# EAGLE design mainboard (EAGLE 5.11)
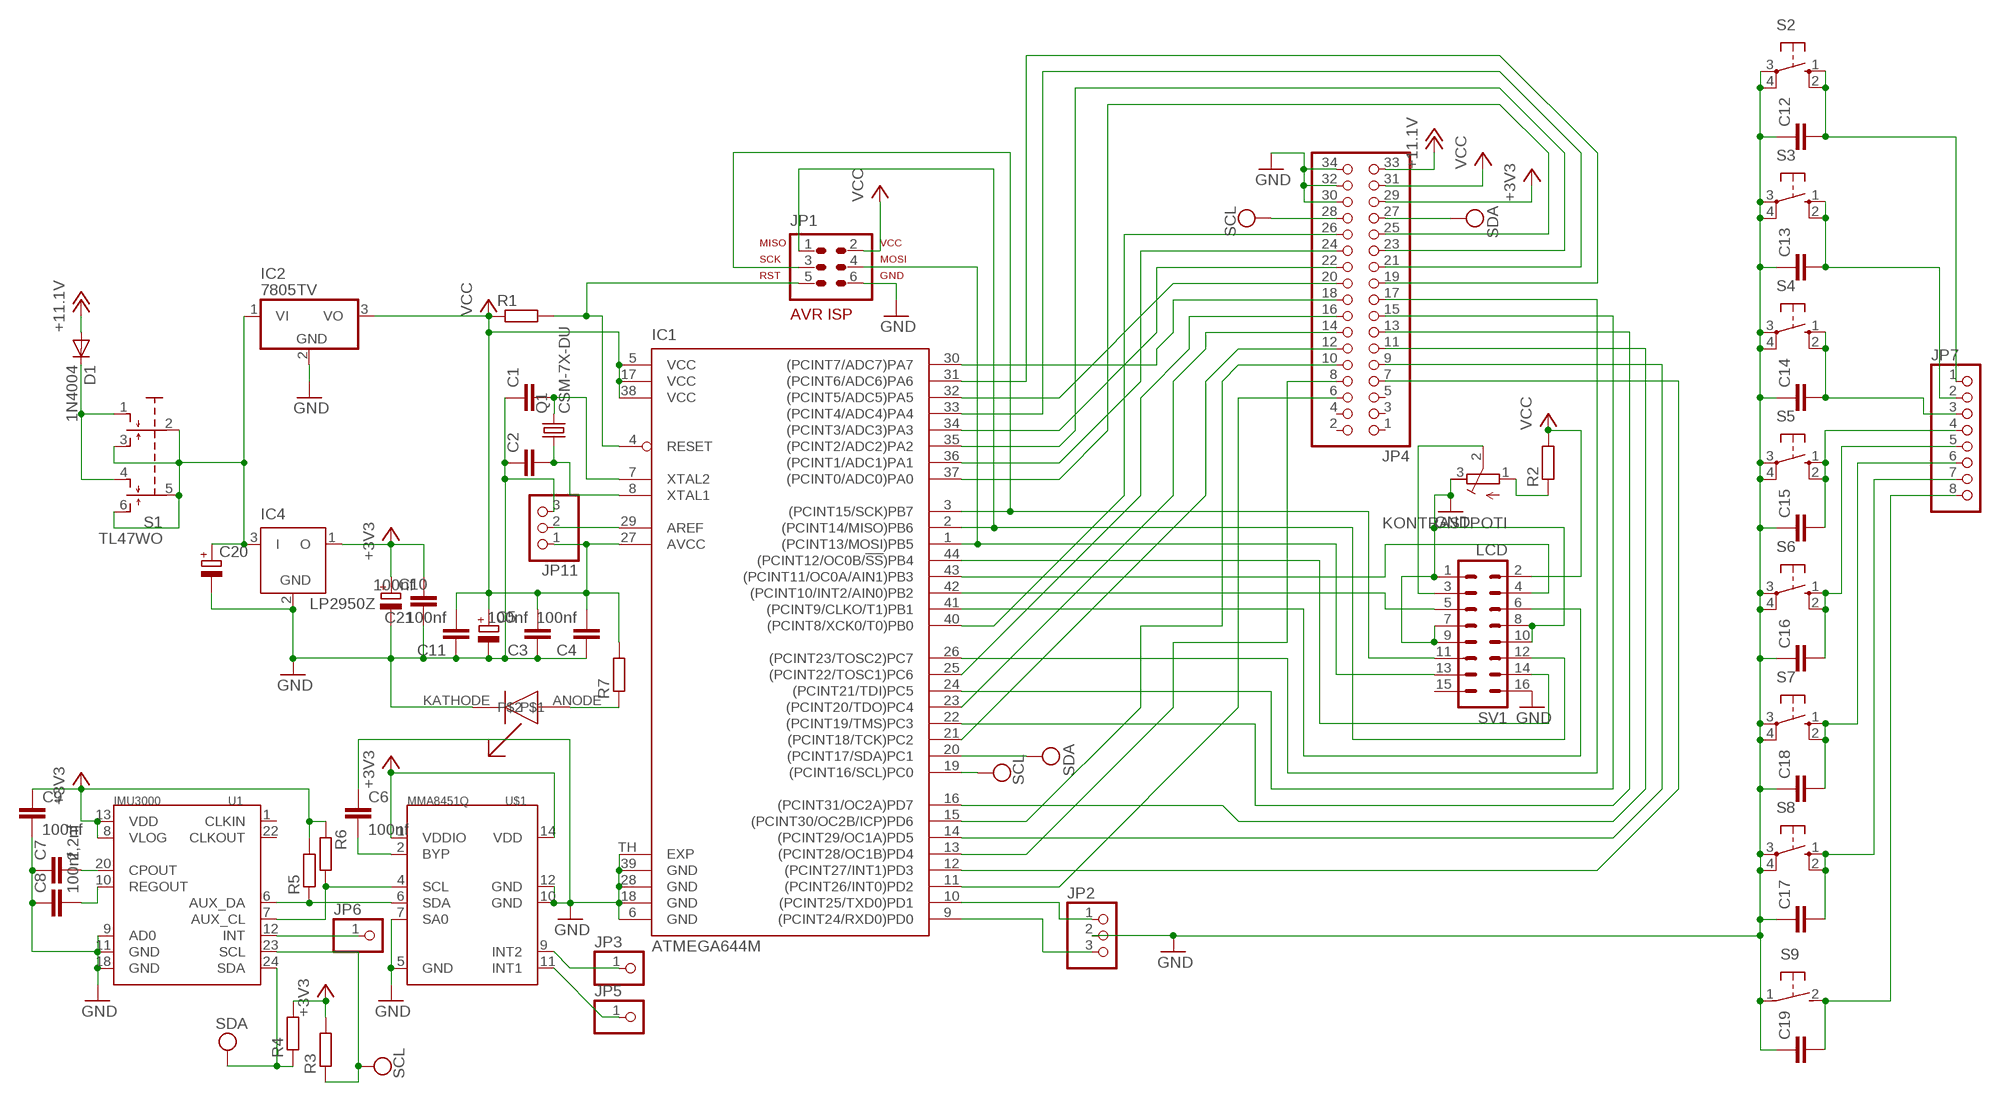
[diagram p0: schematic, sheet 1]

## Parts
C1  C-EUC0805  [C0805]
C2  C-EUC0805  [C0805]
C3  100nf  C-EUC0805  [C0805]
C4  100nf  C-EUC0805  [C0805]
C5  CPOL-EUUD-6,3X7,7  [UD-6,3X7,7_NICHICON]
C6  100nf  C-EUC0805K  [C0805K]
C7  2,2nf  C-EUC0805  [C0805]
C8  100nf  C-EUC0805  [C0805]
C9  100nf  C-EUC0805  [C0805]
C10  CPOL-EUUD-6,3X7,7  [UD-6,3X7,7_NICHICON]
C11  100nf  C-EUC0805  [C0805]
C12  C-EU050-024X044  [C050-024X044]
C13  C-EU050-024X044  [C050-024X044]
C14  C-EU050-024X044  [C050-024X044]
C15  C-EU050-024X044  [C050-024X044]
C16  C-EU050-024X044  [C050-024X044]
C17  C-EU050-024X044  [C050-024X044]
C18  C-EU050-024X044  [C050-024X044]
C19  C-EU050-024X044  [C050-024X044]
C20  CPOL-EUE5-8.5  [E5-8,5]
C21  100nf  C-EUC0805  [C0805]
D1  1N4004  [DO41-10]
IC1  ATMEGA644M  [MLF44-TH]
IC2  7805TV  [TO220V]
IC4  LP2950Z  [TO92]
JP1  AVR-ISP-6HORZ  [AVR-ISP-6R]
JP2  PINHD-1X3/90  [1X03/90]
JP3  PINHD-1X1  [1X01]
JP4  PINHD-2X17/90  [2X17/90]
JP5  PINHD-1X1  [1X01]
JP6  PINHD-1X1  [1X01]
JP7  PINHD-1X8  [1X08]
JP11  PINHD-1X3/90  [1X03/90]
KONTRASTPOTI  R-TRIMM3165W  [RTRIM3165W]
Q1  CSM-7X-DU  [CSM-7X-DU]
R1  R-EU_M0805  [M0805]
R2  R-EU_M0805  [M0805]
R3  R-EU_M0805  [M0805]
R4  R-EU_M0805  [M0805]
R5  R-EU_M0805  [M0805]
R6  R-EU_M0805  [M0805]
R7  R-EU_M0805  [M0805]
S1  TL47WO  [TL4XWO]
S2  10-XX  [B3F-10XX]
S3  10-XX  [B3F-10XX]
S4  10-XX  [B3F-10XX]
S5  10-XX  [B3F-10XX]
S6  10-XX  [B3F-10XX]
S7  10-XX  [B3F-10XX]
S8  10-XX  [B3F-10XX]
S9  31-XX  [B3F-31XX]
SV1  LCD  ML16  [ML16]
U1  IMU3000  [QFN-24]
U$1  MMA8451Q  [QFN16-4X4]
U$2  LEDG3528  [G3528]

## Nets
+3V3: C9.1 C10.+ C21.2 IC4.1(O) JP4.29 R3.2 R4.2 R5.2 R6.1 U1.8(VLOG) U1.13(VDD) U$1.1(VDDIO) U$1.14(VDD)
+12V: D1.A JP4.33 ; supply symbol labelled +11.1V
GND: C1.1 C2.1 C3.1 C4.1 C5.- C6.1 C7.1 C8.1 C9.2 C10.- C11.1 C12.1 C13.1 C14.1 C15.1 C16.1 C17.1 C18.1 C19.1 C20.- C21.1 IC1.6(GND) IC1.18(GND) IC1.28(GND) IC1.39(GND) IC1.TH(EXP) IC2.2(GND) IC4.2(GND) JP1.6 JP2.2 JP4.30 JP4.32 JP4.34 JP11.3 KONTRASTPOTI.3(A) S2.3(P) S2.4(P1) S3.3(P) S3.4(P1) S4.3(P) S4.4(P1) S5.3(P) S5.4(P1) S6.3(P) S6.4(P1) S7.3(P) S7.4(P1) S8.3(P) S8.4(P1) S9.1(P) SV1.1 SV1.7 SV1.8 SV1.9 SV1.10 SV1.16 U1.9(AD0) U1.11(GND) U1.18(GND) U$1.5(GND) U$1.7(SA0) U$1.10(GND) U$1.12(GND) U$2.KATHODE
MISO: IC1.42((PCINT10/INT2/AIN0)PB2) SV1.5
MOSI: IC1.43((PCINT11/OC0A/AIN1)PB3) SV1.4
N$1: KONTRASTPOTI.1(E) R2.1
N$2: JP6.1 U1.12(INT)
N$3: IC1.3((PCINT15/SCK)PB7) JP1.3 SV1.11
N$4: KONTRASTPOTI.2(S) SV1.3
N$5: C2.2 IC1.8(XTAL1) Q1.1
N$6: C1.2 IC1.7(XTAL2) Q1.2
N$7: IC1.10((PCINT25/TXD0)PD1) JP2.1
N$8: IC1.9((PCINT24/RXD0)PD0) JP2.3
N$9: IC1.44((PCINT12/OC0B/!SS!)PB4) SV1.14
N$10: IC1.30((PCINT7/ADC7)PA7) JP4.18
N$11: IC1.22((PCINT19/TMS)PC3) JP4.13
N$12: IC1.21((PCINT18/TCK)PC2) JP4.12
N$13: IC1.1((PCINT13/MOSI)PB5) JP1.4 SV1.13
N$14: IC1.31((PCINT6/ADC6)PA6) JP4.19
N$15: IC1.26((PCINT23/TOSC2)PC7) JP4.17
N$16: IC1.25((PCINT22/TOSC1)PC6) JP4.16
N$17: IC1.24((PCINT21/TDI)PC5) JP4.15
N$18: IC1.23((PCINT20/TDO)PC4) JP4.14
N$19: IC1.16((PCINT31/OC2A)PD7) JP4.11
N$20: IC1.15((PCINT30/OC2B/ICP)PD6) JP4.10
N$22: IC1.14((PCINT29/OC1A)PD5) JP4.9
N$23: IC1.13((PCINT28/OC1B)PD4) JP4.8
N$24: IC1.12((PCINT27/INT1)PD3) JP4.7
N$25: IC1.40((PCINT8/XCK0/T0)PB0) JP4.26
N$26: IC1.11((PCINT26/INT0)PD2) JP4.6
N$27: JP3.1 U$1.9(INT2)
N$28: JP5.1 U$1.11(INT1)
N$32: IC1.29(AREF) JP11.2
N$33: R5.1 U1.6(AUX_DA) U$1.6(SDA)
N$34: R6.2 U1.7(AUX_CL) U$1.4(SCL)
N$36: IC1.2((PCINT14/MISO)PB6) JP1.1 SV1.12
N$38: IC1.33((PCINT4/ADC4)PA4) JP4.21
N$40: IC1.34((PCINT3/ADC3)PA3) JP4.22
N$41: IC1.35((PCINT2/ADC2)PA2) JP4.23
N$42: C8.2 U1.10(REGOUT)
N$43: C7.2 U1.20(CPOUT)
N$44: C6.2 U$1.2(BYP)
N$45: IC1.36((PCINT1/ADC1)PA1) JP4.24
N$46: IC1.37((PCINT0/ADC0)PA0) JP4.25
N$48: IC1.32((PCINT5/ADC5)PA5) JP4.20
N$52: D1.C S1.1(O) S1.4(O1)
N$54: R7.1 U$2.ANODE
N$56: C12.2 JP7.1 S2.1(S) S2.2(S1)
N$57: C13.2 JP7.2 S3.1(S) S3.2(S1)
N$58: C14.2 JP7.3 S4.1(S) S4.2(S1)
N$59: C15.2 JP7.4 S5.1(S) S5.2(S1)
N$60: C16.2 JP7.5 S6.1(S) S6.2(S1)
N$61: C18.2 JP7.6 S7.1(S) S7.2(S1)
N$62: C17.2 JP7.7 S8.1(S) S8.2(S1)
N$63: C19.2 JP7.8 S9.2(S)
N$74: C20.+ IC2.1(VI) IC4.3(I) S1.2(P) S1.3(S) S1.5(P1) S1.6(S1)
RESET: IC1.4(RESET) JP1.5 R1.2
SCK: IC1.41((PCINT9/CLKO/T1)PB1) SV1.6
VCC: C3.2 C4.2 C5.+ C11.2 IC1.5(VCC) IC1.17(VCC) IC1.27(AVCC) IC1.38(VCC) IC2.3(VO) JP1.2 JP4.31 JP11.1 R1.1 R2.2 R7.2 SV1.2
VDD: IC1.20((PCINT17/SDA)PC1) JP4.27 R4.1 U1.24(SDA) ; supply symbol labelled SDA
VSS: IC1.19((PCINT16/SCL)PC0) JP4.28 R3.1 U1.23(SCL) ; supply symbol labelled SCL
Unconnected: JP4.1 JP4.2 JP4.3 JP4.4 JP4.5 SV1.15 U1.1(CLKIN) U1.22(CLKOUT)

## Library data of the parts
C1-C4 C11 C21 = rcl:C-EU: CAPACITOR, European symbol
C5 C10 C20 = rcl:CPOL-EU: POLARIZED CAPACITOR, European symbol
C6-C9 C12-C19 = resistor:C-EU: CAPACITOR, European symbol
D1 = diode:1N4004: DIODE general purpose rectifier, 1 A
IC1 = atmel:ATMEGA644*: 8-bit Microcontroller with 64K Bytes In-System Programmable Flash Source: http://www.atmel.com/dyn/resources/prod_documents/doc2593.pdf; MPN: ATMEGA644P-20MU; OC_FARNELL: 1748528; OC_NEWARK: 26R5636
IC2 = linear:78*: Positive VOLTAGE REGULATOR Source: http://cache.national.com/ds/LM/LM78L05.pdf http://www.fairchildsemi.com/ds/LM/LM7805.pdf
IC4 = linear:LP2950: 100 mA, Low Power Low Dropout Voltage Regulator Source: http://www.onsemi.com/pub/Collateral/LP2950-D.PDF
JP1 = avr-7:AVR-ISP-6: AVR ISP-6 Serial Programming Header
JP2 JP11 = pinhead:PINHD-1X3: PIN HEADER
JP3 JP5 JP6 = pinhead:PINHD-1X1: PIN HEADER
JP4 = pinhead:PINHD-2X17: PIN HEADER
JP7 = pinhead:PINHD-1X8: PIN HEADER
KONTRASTPOTI = resistor:R-TRIMM: Trimm resistor
Q1 = crystal:CSM-7X-DU: SMD CRYSTAL Source: www.ecsxtal.com .. Crystal 3.6864MHz CSM_7X_DU.PDF; OC_FARNELL: unknown; OC_NEWARK: unknown
R1-R7 = resistor:R-EU_: RESISTOR, European symbol
S1 = switch:TL47WO: TINY SWITCH MOM OFF MOM Source: http://www2.produktinfo.conrad.com/datenblaetter/700000-724999/705152-da-01-de-Subminiaturschalter_TL_36WO.pdf
S2-S8 = switch-omron:10-XX: OMRON SWITCH; MPN: B3F-1000; OC_FARNELL: 176432; OC_NEWARK: 36M3542
S9 = switch-omron:31-XX: OMRON SWITCH; MPN: B3F-3100; OC_FARNELL: 959704; OC_NEWARK: 36M3582
SV1 = con-harting-ml:ML16: HARTING; OC_FARNELL: unknown; OC_NEWARK: unknown
U1 = Quadro:IMU3000
U$1 = Quadro:MMA8451Q
U$2 = custom:LEDG3528: LED, G3528-package SMD 3,5 x 2,8mm

## Board
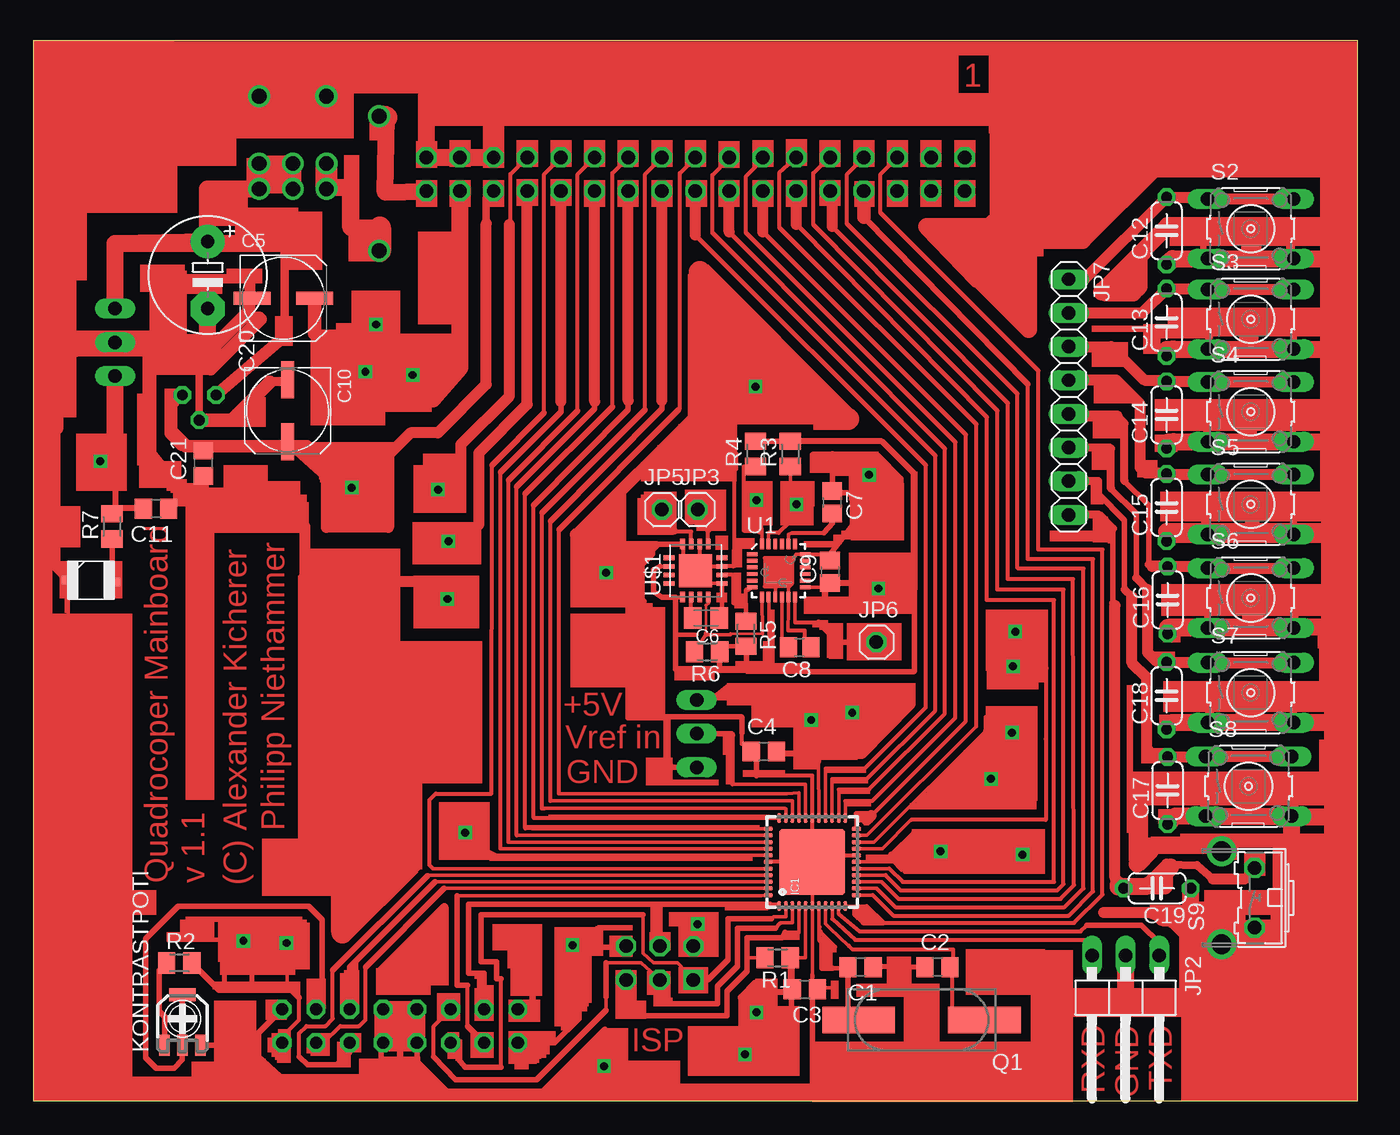
[diagram p1: board, top side]
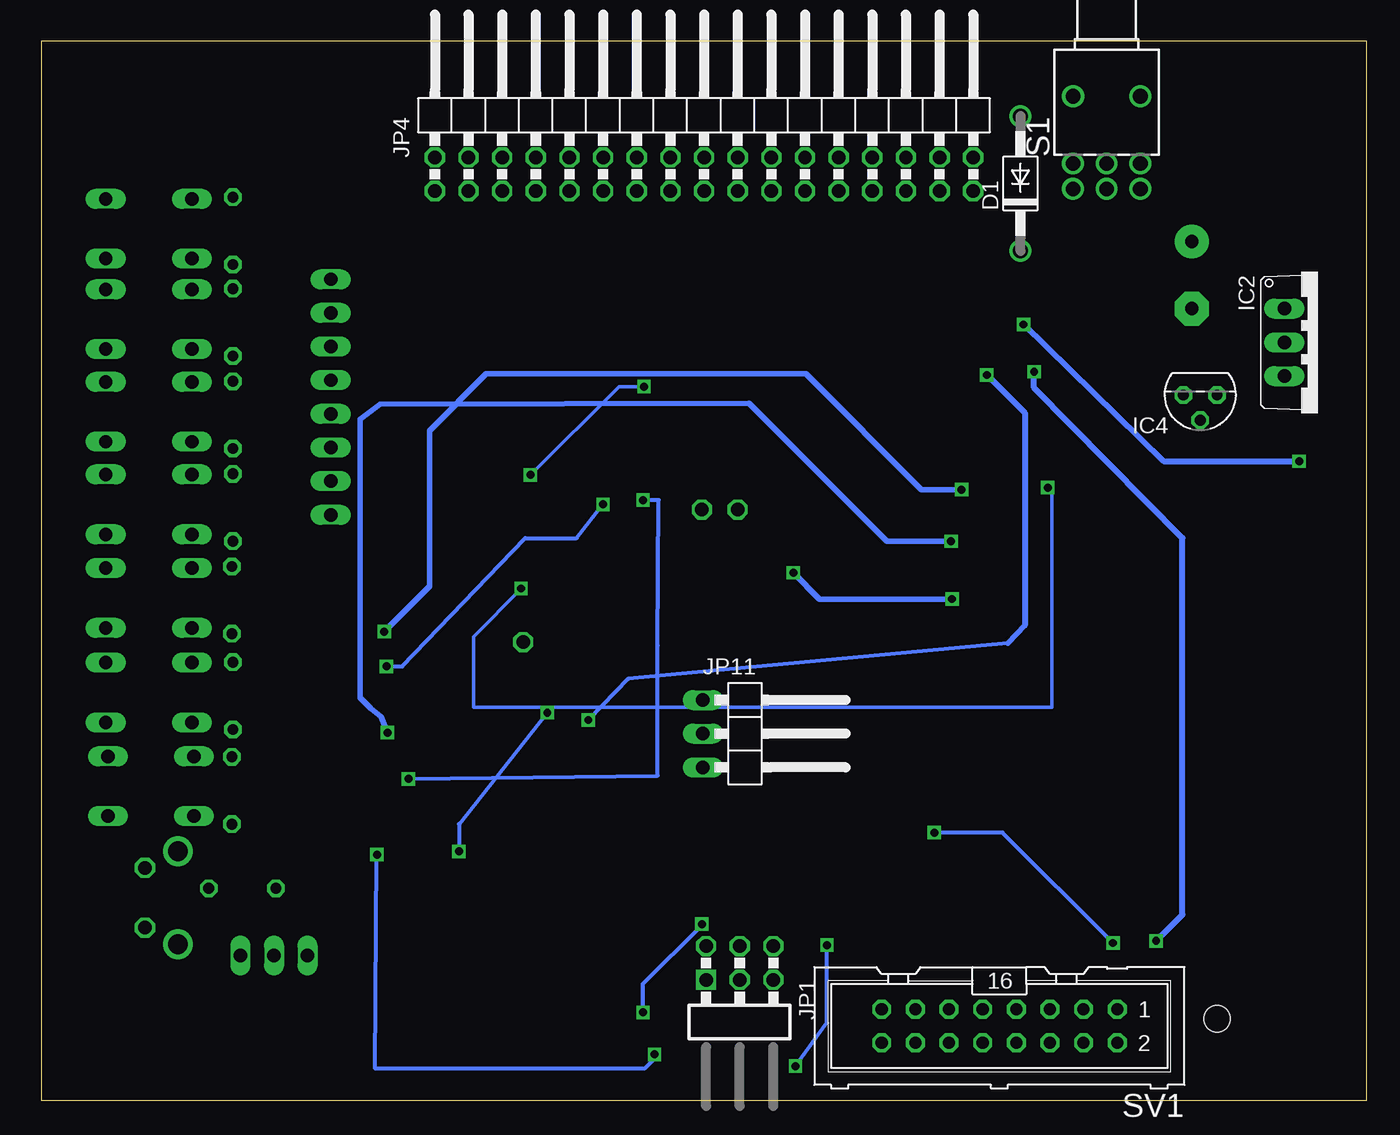
[diagram p2: board, bottom side, seen from below]

Size 100 x 80 mm. Coordinates in mm from the lower left corner, seen from the top.
Outline: 0,0 100,0 100,80 0,80 0,0
Copper layers (1*16): Top 0.035mm / dielectric 1.5mm / Bottom 0.035mm
Design rules "default": minimum track width 10mil, minimum drill 24mil, track to track 8mil, track to pad 8mil, pad to pad 8mil, via to via 8mil, smd to smd 8mil, copper to edge 40mil, drill to drill 8mil, minimum pad ring 10mil, minimum via ring 8mil, stop-mask expansion 4mil, vias tented up to drill 0mil, thermal gap 10mil

### Footprints (pad centres in the part's own frame; a part is rotated, then mirrored left to right if it is on the bottom)
C0805 = smd 1.3 x 1.5: 1 -0.95,0; 2 0.95,0
UD-6,3X7,7_NICHICON = smd 2.8 x 1: + 2.35,0; - -2.35,0
C0805K = smd 1.3 x 1.6: 1 -1,0; 2 1,0
C0805' = smd 1.3 x 1.5: 1 -0.85,0; 2 0.85,0
C050-024X044 = drill 0.813 octagon: 1 -2.54,0; 2 2.54,0
E5-8,5 = drill 1.016 pad 2.54 round: + -2.54,0 | drill 1.016 pad 2.54 octagon: - 2.54,0
DO41-10 = drill 1.118 round: A 5.08,0; C -5.08,0
MLF44-TH = smd 0.7 x 0.3: 1 -3.325,2.5; 2 -3.325,2; 3 -3.325,1.5; 4 -3.325,1; 5 -3.325,0.5; 6 -3.325,0; 7 -3.325,-0.5; 8 -3.325,-1; 9 -3.325,-1.5; 10 -3.325,-2; 11 -3.325,-2.5; 23 3.325,-2.5; 24 3.325,-2; 25 3.325,-1.5; 26 3.325,-1; 27 3.325,-0.5; 28 3.325,0; 29 3.325,0.5; 30 3.325,1; 31 3.325,1.5; 32 3.325,2; 33 3.325,2.5 | smd 0.3 x 0.7: 12 -2.5,-3.325; 13 -2,-3.325; 14 -1.5,-3.325; 15 -1,-3.325; 16 -0.5,-3.325; 17 0,-3.325; 18 0.5,-3.325; 19 1,-3.325; 20 1.5,-3.325; 21 2,-3.325; 22 2.5,-3.325; 34 2.5,3.325; 35 2,3.325; 36 1.5,3.325; 37 1,3.325; 38 0.5,3.325; 39 0,3.325; 40 -0.5,3.325; 41 -1,3.325; 42 -1.5,3.325; 43 -2,3.325; 44 -2.5,3.325 | smd 5 x 5: TH 0,0
TO220V = drill 1.016 long: 1 -2.54,-2.54; 2 0,-2.54; 3 2.54,-2.54
TO92 = drill 0.813 octagon: 1 -1.27,0; 2 0,1.905; 3 1.27,0
AVR-ISP-6R = drill 1.016 square: 1 -2.54,-1.27 | drill 1.016 octagon: 2 -2.54,1.27; 3 0,-1.27; 4 0,1.27; 5 2.54,-1.27; 6 2.54,1.27
1X03/90 = drill 1.016 long: 1 -2.54,-3.81; 2 0,-3.81; 3 2.54,-3.81
1X01 = drill 1.016 octagon: 1 0,0
2X17/90 = drill 1.016 octagon: 1 -20.32,-6.35; 2 -20.32,-3.81; 3 -17.78,-6.35; 4 -17.78,-3.81; 5 -15.24,-6.35; 6 -15.24,-3.81; 7 -12.7,-6.35; 8 -12.7,-3.81; 9 -10.16,-6.35; 10 -10.16,-3.81; 11 -7.62,-6.35; 12 -7.62,-3.81; 13 -5.08,-6.35; 14 -5.08,-3.81; 15 -2.54,-6.35; 16 -2.54,-3.81; 17 0,-6.35; 18 0,-3.81; 19 2.54,-6.35; 20 2.54,-3.81; 21 5.08,-6.35; 22 5.08,-3.81; 23 7.62,-6.35; 24 7.62,-3.81; 25 10.16,-6.35; 26 10.16,-3.81; 27 12.7,-6.35; 28 12.7,-3.81; 29 15.24,-6.35; 30 15.24,-3.81; 31 17.78,-6.35; 32 17.78,-3.81; 33 20.32,-6.35; 34 20.32,-3.81
1X08 = drill 1.016 long: 1 -8.89,0; 2 -6.35,0; 3 -3.81,0; 4 -1.27,0; 5 1.27,0; 6 3.81,0; 7 6.35,0; 8 8.89,0
RTRIM3165W = smd 0.8 x 1.6: 1 -1.35,-2; 2 0,-2; 3 1.35,-2 | smd 2 x 1: 4 0,1.8 | hole 2: 0,0
CSM-7X-DU = smd 5.5 x 2: 1 -4.75,0; 2 4.75,0
M0805 = smd 1.3 x 1.6: 1 -0.95,0; 2 0.95,0
TL4XWO = drill 1.1 pad 1.422 round: 1 -2.54,-5.08; 2 0,-5.08; 3 2.54,-5.08; 4 -2.54,-6.985; 5 0,-6.985; 6 2.54,-6.985 | drill 1.1 pad 1.676 round: M1 -2.54,0; M2 2.54,0
B3F-10XX = drill 1.016 long: 1 -3.251,2.261; 2 3.251,2.261; 3 -3.251,-2.261; 4 3.251,-2.261
B3F-31XX = drill 1.016 octagon: 1 -2.261,-1.245; 2 2.261,-1.245 | drill 1.499 pad 2.159 round: 3 -3.505,1.245; 4 3.505,1.245
ML16 = drill 0.914 octagon: 1 -8.89,-1.27; 2 -8.89,1.27; 3 -6.35,-1.27; 4 -6.35,1.27; 5 -3.81,-1.27; 6 -3.81,1.27; 7 -1.27,-1.27; 8 -1.27,1.27; 9 1.27,-1.27; 10 1.27,1.27; 11 3.81,-1.27; 12 3.81,1.27; 13 6.35,-1.27; 14 6.35,1.27; 15 8.89,-1.27; 16 8.89,1.27
QFN-24 = smd 0.8 x 0.3: 1 -2,1.25; 2 -2,0.75; 3 -2,0.25; 4 -2,-0.25; 5 -2,-0.75; 6 -2,-1.25; 13 2,-1.25; 14 2,-0.75; 15 2,-0.25; 16 2,0.25; 17 2,0.75; 18 2,1.25 | smd 0.3 x 0.8: 7 -1.25,-2; 8 -0.75,-2; 9 -0.25,-2; 10 0.25,-2; 11 0.75,-2; 12 1.25,-2; 19 1.25,2; 20 0.75,2; 21 0.25,2; 22 -0.25,2; 23 -0.75,2; 24 -1.25,2
QFN16-4X4 = smd 0.8 x 0.35: 1 -2,0.975; 2 -2,0.325; 3 -2,-0.325; 4 -2,-0.975; 9 2,-0.975; 10 2,-0.325; 11 2,0.325; 12 2,0.975 | smd 0.35 x 0.8: 5 -0.975,-2; 6 -0.325,-2; 7 0.325,-2; 8 0.975,-2; 13 0.975,2; 14 0.325,2; 15 -0.325,2; 16 -0.975,2 | smd 2.5 x 2.5: EXP 0,0
G3528 = smd 1.27 x 0.635: ANODE 1.587,-0.159; KATHODE -1.587,0

### Placement (x,y rotation side)
C1  62.47,10.08 180 top
C2  68.26,10.08 0 top
C3  58.26,8.41 180 top
C4  55.17,26.35 0 top
C5  18.89,60.56 0 top
C6  50.8,36.43 180 top
C7  2,2nf  [C0805']  60.33,45.16 270 top
C8  100nf  [C0805']  57.86,34.21 180 top
C9  100nf  [C0805']  60.17,39.93 90 top
C10  19.21,52.07 270 top
C11  9.29,44.69 180 top
C12  85.57,65.64 90 top
C13  85.57,58.74 90 top
C14  85.57,51.75 90 top
C15  85.57,44.77 90 top
C16  85.65,37.78 90 top
C17  85.65,23.42 90 top
C18  85.57,30.56 90 top
C19  84.85,16.03 180 top
C20  13.18,62.31 270 top
C21  12.86,48.1 90 top
D1  26.11,69.22 90 bottom
IC1  58.82,18.02 90 top
IC2  3.65,57.23 270 bottom
IC4  12.54,53.26 180 bottom
JP1  47.31,10.4 0 bottom
JP2  82.47,7.14 180 top
JP3  50.16,44.61 0 top
JP4  50,75 0 bottom
JP5  47.47,44.61 0 top
JP6  63.66,34.61 0 top
JP7  78.18,53.1 270 top
JP11  46.28,27.7 270 bottom
KONTRASTPOTI  11.27,6.19 0 top
Q1  67.07,6.11 180 top
R1  56.2,10.8 180 top
R2  11.03,10.4 0 top
R3  57.15,48.82 90 top
R4  54.53,48.82 90 top
R5  53.82,35.24 270 top
R6  50.88,33.89 180 top
R7  5.95,43.34 90 top
S1  19.61,75.8 0 bottom
S2  91.92,65.8 0 top
S3  91.92,58.98 0 top
S4  91.92,51.99 0 top
S5  91.92,45.01 0 top
S6  91.92,37.94 0 top
S7  91.92,30.8 0 top
S8  91.76,23.73 0 top
S9  90.96,15.32 90 top
SV1  27.7,5.64 180 bottom
U1  56.27,40 0 top
U$1  50,40 90 top
U$2  4.37,39.29 0 top

### Tracks (layer width: path | path; a pad name or v marks a point on that pad's centre or on a via)
+3V3  (via drill 0.6)
  Top 0.254: U$1.1 48.74,37.95 | U$1.14
  Top 0.27: 60.19,39.05 59.89,38.75 U1.13 | R6.1 52.23,34.29 R5.2 53.9,34.21 53.9,32.7 54.05,32.54 55.56,32.54 | 58.42,32.54 55.56,32.54 | U1.8 55.56,37.96 55.56,32.54 | 34.21,54.05 30.48,50.32 28.73,50.32 24.69,46.28 v24.05,46.28 | v63.82,38.66 63.82,39.45 63.34,39.45
  Top 0.305: 48.5,38 U$1.1 | 47.31,40.32 U$1.14
  Top 0.406: R6.1 51.83,32.54 52.55,32.54 48.5,32.54 48.5,33.89 48.5,38 47.49,38 46.83,38.42 46.83,40.08 47.31,40.32 | R4.2 56.99,49.77 R3.2
  Top 0.408: 58.42,32.54 58.58,32.38 66.44,32.38 66.52,32.46 66.52,40.48
  Top 0.45: R3.2 64.06,49.77 66.52,47.31 66.52,40.48 66.52,40.32 66.28,40.08 63.98,40.08 63.34,39.45 62.94,39.05 60.19,39.05 C9.1 | C21.2 12.7,49.21 11.99,49.21
  Top 0.56: IC4.1 | IC4.1 10.32,52.07 10.32,50.56 11.43,49.21 11.99,49.21 18.7,49.21 C10.+ | JP4.29 34.21,68.1 34.21,66.2
  Top 0.813: 34.21,66.2 34.21,54.05 30.56,50.4 28.5,50.4 26.83,48.74 26.83,43.26 22.15,43.26 22.15,47.1 C10.+
  Bottom 0.27: v24.05,46.28 23.73,45.96 23.73,29.69 67.39,29.69 67.39,35 v63.82,38.66
+12V
  Top 1.27: JP4.33 26.59,68.57 26.67,74.22
  Top 1.676: 26.67,74.22 D1.A
GND  (via drill 0.6)
  Top 0.254: IC1.TH arc-90 59.32,18.52 | 82.47,8.57 82.39,8.49 | 26.27,4.37 SV1.8 | 44.69,11.59 JP1.6 | C6.1 52,36.62 | U$1.12 49.05,42.03 | 52.94,40.4 52.86,40.32 | U1.11 57.02,38.76 | U1.18 57.6,41.25 57.31,40.72 | 58.26,34.51 C8.1 | 57.02,38.71 56.99,38.81 | 56.04,38.81 56.04,37.86 U1.9 | 60.46,45.88 C7.1 | 48.02,28.97 48.02,25.64 | 58.82,6.19
  Top 0.27: IC1.TH IC1.6 58.82,9.53 | 56.99,35.48 57.02,37.04 U1.11 57.02,38.71 | 50.96,39.05 51.99,39.05 | 58.82,48.82 61.91,48.82 61.91,47.23 v63.1,47.23 | v54.53,53.9 53.02,52.39 53.02,48.82
  Top 0.305: IC1.39 IC1.TH IC1.28 58.82,24.53 54.61,24.53 54.61,25.8 53.5,26.99 | 59.32,18.52 IC1.18 | 53.5,26.99 53.5,27.78 | 53.5,26.99 53.5,26.91 | 52.86,40.32 U$1.7 | 52.94,41.51 52.94,47.7 53.02,47.7 | 60.33,48.82 58.82,48.82 | 58.82,9.53 58.82,9.29 | 58.82,9.53 | 58.82,8.02 58.82,8.33 | 58.82,8.33 58.82,9.53 | 57.02,38.76 57.31,39.05 57.31,40.72 57.31,40.96 55.24,40.96 55.24,38.81 56.04,38.81 | 56.99,35.48 58.26,35.48 58.26,34.51 | 56.99,38.81 56.12,38.81 | 60.18,41.28 U1.18 60.16,41.25 C9.2 | 64.77,10.16 63.42,10.16 | C3.1 59.21,8.33 58.82,8.33 | 41.2,6.19 40.48,6.19 v40.72,11.75 | 60.35,46.51 60.35,46.04 C7.1 | 52,36.62 U$1.5 | C6.1 51.99,36.62 51.99,39.05 | 50.96,39.05 51.04,39.13 51.04,40.32 51.04,40.33 | 51.04,40.33 U$1.7 | 50.33,41.04 51.04,40.33 | 50.33,41.04 U$1.10 | 49.05,42.03 49.05,41.04 49.06,41.04 50.33,41.04
  Top 0.406: 58.82,8.02 58.82,6.19 58.82,1.03 53.66,1.03 | KONTRASTPOTI.3 16.1,4.19 | 16.1,4.19 SV1.1 | 26.27,4.37 26.27,1.83 18.7,1.83 16.1,4.19 | SV1.16 39.37,4.37 41.2,6.19 41.2,10.4 42.39,11.59 44.69,11.59 | 52.94,40.4 52.94,41.51 | 53.02,47.7 53.02,47.86 53.02,48.82 | 60.35,46.51 60.33,48.82 | SV1.10 28.97,2.94 31.19,0.71 38.5,0.71 43.18,5.4 v43.1,2.62 43.18,1.11 | 43.18,1.11 53.58,1.03 53.54,1.07 | 53.54,1.07 53.66,1.11 43.18,1.11 | JP2.2 | JP2.2 82.47,8.57 | 53.66,1.03 53.58,1.11 66.99,1.11 67.15,6.35 66.12,6.35 66.12,10.08 64.77,10.16 | 43.18,1.11 53.66,1.03 | 53.54,1.07 59.17,1.03 | C1.1 63.42,10.16 C2.1 | 60.18,41.28 61.83,43.42 61.83,45.09 | 61.83,45.09 61.83,45.56 61.44,45.88 60.46,45.88 | 53.5,27.78 53.5,28.89 53.42,28.97 48.02,28.97 47.7,28.97 47.78,28.89 | JP11.3 48.26,25.16 47.78,25.64 47.78,28.89 | 47.78,28.89 44.93,28.89 44.93,37.7 46.12,37.7 45.96,37.78 45.96,40.48 46.75,41.27 46.75,41.59 | 46.75,41.59 47.16,42 U$1.12 | 63.26,45.16 63.18,45.09 61.83,45.09 | 12.94,79.3 13.26,79.3 | 46.75,41.59 45.01,39.85 v43.26,39.85 | U$1.7
  Top 0.408: C10.- 19.08,54.29 | 54.61,24.53 54.61,25.96
  Top 0.45: 54.61,25.96 C4.1 | C21.1 12.62,46.91 12.62,45.4 | C11.1 11.17,45.62 11.49,45.62 11.49,45.58 11.67,45.4
  Top 0.56: IC4.2 12.54,57.07 12.38,57.23 | 17.86,54.21 19,54.21 C10.-
  Top 0.649: 19.08,54.29 17.78,54.29
  Top 0.813: JP2.2 82.47,7.86 78.11,7.86 78.11,1.11 66.99,1.11 | v31.27,37.86 29.61,39.21 20.56,39.21 20.48,39.61 20.48,43.42 18.49,45.4 12.62,45.4 11.67,45.4 8.65,49.13 8.65,56.75 8.18,57.23 | 1.67,50.8 1.67,40.4 U$2.KATHODE
  Top 1.016: IC4.2 15,51.35 17.86,54.21 | C5.- 16.27,60.29 16.27,59.53 13.97,57.23 13.18,57.23
  Top 1.27: SV1.8 SV1.10 SV1.9 SV1.7 SV1.8 | SV1.8 | JP4.30 JP4.32 JP4.34 29.68,72.63 29.69,79.3 12.94,79.3 7.62,79.3 1.59,73.18 1.59,56.52 | 1.59,56.52 IC2.2 8.18,57.23 12.38,57.23 13.18,57.23 C20.- | 1.67,50.8 1.59,56.52 | C17.1 86.24,21.47 S8.3 88.67,21.43 95.57,21.43 | 99.38,28.54 99.38,21.43 95.57,21.43 | 95.57,21.43 95.57,21.47 S8.4 95.01,13.06 S9.1 89.69,12.98 | C19.1 87.39,13.46 89.69,12.98 | C18.1 arc-90 86.08,28.54 S7.3 S7.4 99.38,28.54 | S6.4 S6.3 86.08,35.68 arc90 C16.1 | S2.4 S2.3 86,63.54 C12.1 85.96,63.5 98.98,63.5 98.98,56.72 S3.4 S3.3 86.08,56.72 arc90 C13.1 85.57,56.67 98.98,56.67 98.98,49.73 S4.4 89.25,49.73 arc-90 89.22,49.77 88.7,49.77 arc90 S4.3 86.08,49.73 arc90 C14.1 85.57,49.69 99.14,49.69 99.14,42.74 S5.4 S5.3 86.08,42.74 arc90 C15.1 85.57,42.94 99.3,42.94 99.3,35.72 | 86.12,35.72 C16.1 | 99.3,35.72 99.38,35.72 99.38,28.54 | 99.3,35.72 86.12,35.72 | C16.1 85.65,35.72 86.12,35.72 | JP2.2 82.47,7.46 89.77,7.46 89.69,12.98
  Bottom 0.27: v63.1,47.23 56.44,53.9 v54.53,53.9
  Bottom 0.305: v40.72,11.75 40.72,5.87 v43.1,2.62
  Bottom 0.406: v43.26,39.85 41.27,37.86 v31.27,37.86
MISO
  Top 0.254: SV1.5
  Top 0.27: 30.33,16.52 IC1.42
  Top 0.406: 30.33,16.52 23.89,10.08 SV1.5
MOSI
  Top 0.254: 21.99,4.45 21.43,4.45 SV1.4
  Top 0.27: 31.02,16.02 IC1.43
  Top 0.305: 25.08,10.08 25.08,6.11 24.61,5.64 23.18,5.64 21.99,4.45
  Top 0.406: 25.08,10.08 31.02,16.02
N$1
  Top 0.254: 9.53,9.84 R2.1
  Top 0.406: KONTRASTPOTI.1 9.92,6.35 9.53,6.75 9.53,9.84
N$2
  Top 0.27: U1.12 57.53,36.09
  Top 0.305: 57.53,36.09 59.29,36.12
  Top 0.406: 59.29,36.12 60.17,35.24 60.17,34.61 60.33,34.61 61.67,34.61 JP6.1
N$3
  Top 0.254: 56.04,13.02 | 56.44,13.41 57.32,13.41 IC1.3 | 43.26,6.83 43.26,7.86 | 43.26,10.4 45.88,10.4 JP1.3
  Top 0.305: 56.04,13.02 56.44,13.41 | 30.24,3.33 30.24,5.64 SV1.11
  Top 0.406: JP1.3 47.31,8.18 48.18,7.3 51.67,7.3 51.67,8.65 53.18,10.16 53.18,13.02 56.04,13.02 | 43.26,6.83 38.02,1.59 31.91,1.59 30.24,3.33 | 43.26,7.86 43.26,10.4
N$4
  Top 0.254: 21.83,7.38 SV1.3
  Top 0.406: KONTRASTPOTI.2 11.27,3.1 10.64,2.46 9.29,2.46 8.49,3.25 8.49,12.22 10.95,14.68 20.8,14.68 21.83,13.65 21.83,7.38
N$5
  Top 0.254: IC1.8 59.82,13.37 60.17,13.02 61.56,11.7
  Top 0.305: C2.2 69.42,10.16 69.45,11.43 66.52,11.43 | 66.52,11.43 | 66.52,11.43 | 61.56,11.7 61.88,11.43 66.52,11.43 | 69.37,10.23 69.37,6.11 Q1.1
  Top 0.406: C2.2 69.37,10.23
N$6
  Top 0.254: IC1.7 59.32,13.12 59.37,13.1 | C1.2 60.33,10
  Top 0.305: 59.45,12.06 59.37,12.06 59.37,13.1
  Top 0.406: Q1.2 61.52,6.11 C1.2 | 60.33,10 59.53,10 59.53,12.06 59.45,12.06
N$7
  Top 0.254: 62.39,12.78 62.55,12.78 | 60.8,14.13 60.8,14.71 IC1.10
  Top 0.305: 79.53,13.26 79.06,12.78 62.55,12.78 | 60.8,14.13 62.39,12.78
  Top 0.406: 79.53,13.26 83.66,13.26 85.01,11.91 JP2.1
N$8
  Top 0.254: 60.33,13.73 IC1.9
  Top 0.305: 60.33,13.73 62.07,12.14 79.93,12.14 JP2.3
N$9
  Top 0.254: 54.98,15.48 IC1.44 | 51.12,15.48 50.8,15.48 | 31.99,8.73 31.99,8.81
  Top 0.27: 50.8,15.48 54.98,15.48 | 31.99,15.48 51.12,15.48
  Top 0.305: 32.78,5.64 32.78,8.73
  Top 0.406: 31.99,8.81 31.99,15.48 | 32.78,8.73 31.99,8.73 | SV1.14 32.78,5.64
N$10
  Top 0.254: 48.74,52.15 48.82,52.23
  Top 0.27: IC1.30 57.82,23.23 56.91,23.18 39.69,23.18
  Top 0.305: 48.82,52.23 48.82,70.01 JP4.18 | 39.69,23.18 39.69,43.1
  Top 0.406: 39.69,43.1 48.74,52.15
N$11
  Top 0.305: IC1.22 62.14,21.67 | 63.42,21.67 70.41,28.65 70.41,50.24
  Top 0.35: 70.41,50.24 55.08,65.57
  Top 0.406: 62.14,21.67 63.42,21.67
  Top 0.813: 55.08,65.57 JP4.13
N$12
  Top 0.27: IC1.21 62.96,20.02 71.2,28.26
  Top 0.305: 71.2,28.26 71.2,51.04 | 56.36,65.88 56.36,70.08 JP4.12
  Top 0.35: 71.2,51.04 56.36,65.88
N$13
  Top 0.254: IC1.1 56.29,14.85 55.64,14.84
  Top 0.406: 55.64,14.84 55.24,14.84 47.78,14.84 47.31,14.84 | 47.31,14.84 47.31,13.65 JP1.4 47.31,14.84 32.86,14.84 32.86,9.6 34.05,9.6 SV1.13 | 47.31,14.84
N$14
  Top 0.254: 57.32,22.53 57.31,22.54 57.31,22.62 | 39.05,22.62
  Top 0.27: 57.32,22.53 IC1.31 | 39.05,22.62 57.31,22.62
  Top 0.305: 39.05,22.62 39.05,43.74
  Top 0.406: 47.47,52.86 47.47,52.23 39.05,43.74
  Top 0.813: 47.47,52.86 JP4.19
N$15
  Top 0.27: IC1.26 59.82,25.08
  Top 0.305: 59.82,25.08 62.79,25.08 67.39,29.69 67.39,47.94
  Top 0.35: 67.39,47.94 50,65.33
  Top 0.813: 50,65.33 JP4.17
N$16
  Top 0.27: IC1.25 60.32,24.29
  Top 0.305: 60.32,24.29 62.94,24.29 68.1,29.45 68.1,48.66 | 51.28,65.48 51.28,69.85 52.54,71.11 JP4.16
  Top 0.35: 68.1,48.66 51.28,65.48
N$17
  Top 0.27: IC1.24 60.82,23.5
  Top 0.305: 60.82,23.5 63.1,23.5 68.82,29.21 68.82,49.21
  Top 0.35: 68.82,49.21 52.54,65.57
  Top 0.813: 52.54,65.57 JP4.15
N$18
  Top 0.27: IC1.23 61.32,22.62
  Top 0.305: 61.32,22.62 63.34,22.62 69.61,28.89 69.61,49.69 | 53.82,65.48 53.82,69.77 55.08,71.03 JP4.14
  Top 0.35: 69.61,49.69 53.82,65.48
N$19
  Top 0.27: IC1.16 64.64,17.52
  Top 0.305: 71.99,51.59 71.99,37.78 77.07,37.78 77.07,16.51 65.64,16.51 64.64,17.52
  Top 0.35: 71.99,51.59 57.62,66.13
  Top 0.813: 57.62,66.13 JP4.11
N$20
  Top 0.27: IC1.15 64.34,17.02
  Top 0.305: 64.34,17.02 65.48,15.88 77.31,15.88 77.79,16.35 77.79,38.58 72.79,38.58 72.79,52.07 | 58.9,66.12 58.9,70.01 JP4.10
  Top 0.35: 72.79,52.07 58.9,66.12
N$21
  Top 0.406: 11.27,4.37 11.27,7.86
N$22
  Top 0.27: IC1.14 64.05,16.52
  Top 0.305: 64.05,16.52 65.33,15.24 77.55,15.24 78.58,16.27 78.5,39.37 73.58,39.37 73.58,52.63 | 60.33,68.26 JP4.9
  Top 0.35: 73.58,52.63 60.33,65.96
  Top 0.813: 60.33,65.96 60.33,68.26
N$23
  Top 0.27: IC1.13 63.67,16.02
  Top 0.305: 63.67,16.02 65.09,14.61 77.87,14.61 79.3,16.03 79.3,40.16 74.37,40.16 74.3,40.24 74.3,53.34 | 61.44,66.2 61.44,69.93 JP4.8
  Top 0.35: 74.3,53.34 61.44,66.2
N$24
  Top 0.27: IC1.12 63.38,15.52
  Top 0.305: 63.38,15.52 64.93,13.97 78.18,13.97 80.01,15.8 80.01,40.88 75.09,40.88 75.09,54.05 | 62.71,68.58 JP4.7
  Top 0.406: 75.09,54.05 62.71,66.67
  Top 1.016: 62.71,66.67 62.71,68.58
N$25
  Top 0.27: 30.19,17.52 IC1.40
  Top 0.305: 38.58,51.91 38.58,69.93 JP4.26 | 30.19,17.52 29.92,17.78 29.92,22.7 30.4,23.18 34.61,23.18 34.63,47.97
  Top 0.406: 34.63,47.97 38.58,51.91
N$26
  Top 0.305: IC1.11 62.94,14.69 64.21,13.41 78.58,13.41 80.72,15.56 80.72,41.59 75.88,41.59 75.88,55.09 | 63.98,66.99 63.98,69.93 JP4.6
  Top 0.35: 75.88,55.09 63.98,66.99
N$27
  Top 0.305: 50.96,43.02 50.96,42.06 U$1.9
  Top 0.406: JP3.1 51.59,43.58 50.96,43.02
N$28
  Top 0.305: U$1.11 49.67,42.96 48.42,42.94
  Top 0.406: 48.42,42.94 48.42,43.1 JP5.1
N$29
  Top 0.61: 26.19,9.76 31.04,14.61 30.8,13.97
N$30
  Top 0.305: 62.63,13.41 61.99,14.05 61.99,14.37
N$31
  Top 0.305: 60.56,11.59 59.45,12.7 59.45,12.78
N$32
  Top 0.27: IC1.29 58.32,23.89 52.78,23.89
  Top 0.357: 52.81,27.6 52.78,23.89
  Top 0.406: 52.81,27.6 52.7,27.7 JP11.2
N$33
  Top 0.305: U1.6 54.02,38.57 53.82,38.57 53.82,38.58 R5.1 53.81,37.54 52.86,37.54 52.86,39.61 52.8,39.67 U$1.6
N$34
  Top 0.2: 52.63,35.24 55.04,35.24 | 50.8,35.32 50.8,37.39
  Top 0.254: 50.96,37.99 U$1.4 50.98,37.56 50.8,37.39 | 55.04,35.24 U1.7 | 52.63,35.24 52.63,35.16 50.8,35.16 | 52.63,35.24
  Top 0.305: R6.2 50.8,35.16 50.8,35.32
N$35
  Top 0.6: 53.5,7.78 54.61,8.89
N$36
  Top 0.254: IC1.2 56.83,14.69 56.83,13.89 55.88,13.89 55.72,13.73 | 46.04,14.05 46.04,11.11 46.83,10.4 48.66,10.4 JP1.1
  Top 0.305: 35.32,2.54 35.32,9.21
  Top 0.406: 55.72,13.73 52.47,13.73 52.47,10.64 50.96,9.13 JP1.1 | 35.32,9.21 35,9.21 35,10.48 33.81,10.48 | 33.81,10.48 | 33.81,10.48 33.81,14.05 46.04,14.05 | 35.32,2.54 32.62,2.54 32.07,3.17 32.07,3.81 SV1.12
N$37
  Top 0.305: 54.13,8.26 54.13,8.18
N$38
  Top 0.305: IC1.33 38.35,21.34 37.78,21.35 37.78,44.93
  Top 0.406: 44.93,52.86 44.93,52.15 37.78,44.93
  Top 0.813: 44.93,52.86 JP4.21
N$39
  Top 0.61: 65.41,46.75 65.41,46.91 63.66,48.66 63.66,48.42 65.41,46.67
N$40
  Top 0.254: 37.66,20.52 37.23,20.56 37.15,20.56 37.39,20.56
  Top 0.27: 37.66,20.52 IC1.34
  Top 0.305: 43.74,52.39 43.74,70.01 JP4.22 | 37.15,20.56 37.15,45.8
  Top 0.406: 37.15,45.8 43.74,52.39
N$41
  Top 0.27: 36.5,20.02 IC1.35
  Top 0.305: 36.5,20.02 36.5,46.34
  Top 0.406: 42.39,52.78 42.39,52.23 36.5,46.34
  Top 0.813: 42.39,52.78 JP4.23
N$42
  Top 0.254: C8.2 56.52,34.23
  Top 0.27: 56.52,34.23 U1.10
N$43
  Top 0.27: U1.20 57.02,42.76 57.31,42.86
  Top 0.305: 57.31,42.86 59.69,42.86
  Top 0.406: 59.69,42.86 60.33,43.58 C7.2
N$44
  Top 0.254: C6.2 49.67,36.87
  Top 0.305: 49.67,36.87 U$1.2
N$45
  Top 0.27: 35.89,19.52 IC1.36
  Top 0.305: 41.12,52.07 41.12,69.93 JP4.24 | 35.89,19.52 35.89,46.84
  Top 0.406: 35.89,46.84 41.12,52.07
N$46
  Top 0.27: 35.27,19.02 IC1.37
  Top 0.305: 35.27,19.02 35.27,47.42
  Top 0.406: 39.85,52.78 39.85,51.99 35.27,47.42
  Top 0.813: 39.85,52.78 JP4.25
N$47
  Top 0.813: 62.23,26.19 62.55,26.19 66.2,29.92
N$48
  Top 0.254: 56.75,22.07 56.82,22.05
  Top 0.27: 56.82,22.05 IC1.32 | 38.58,22.07 56.75,22.07
  Top 0.305: 46.2,52.15 46.2,69.93 JP4.20 | 38.42,44.37 38.42,22.07 38.58,22.07
  Top 0.406: 38.42,44.37 46.2,52.15
N$49
  Top 0.813: 62.94,21.19 63.26,21.51
N$51
  Top 0.305: 50.4,43.26 50.32,43.26 49.69,43.89
N$52
  Top 1.27: 26.19,65.88 23.97,65.88 23.97,68.9 22.15,68.9 S1.4
  Top 1.676: D1.C 26.19,64.14 26.19,65.88 | S1.4 S1.1
N$53
  Top 1.676: 61.52,51.44 61.36,51.51 50.32,62.55
N$54
  Top 0.408: U$2.ANODE R7.1
N$55
  Top 0.9: 41.04,42.7 50.48,52.15
  Top 1.016: 50.48,52.15 50.16,50.96 | 41.04,42.7 41.91,42.7 41.99,42.78
N$56
  Top 0.813: S2.2 S2.1 88.54,68.18 C12.2 79.38,61.99 JP7.1
N$57
  Top 0.813: S3.2 S3.1 88.7,61.28 C13.2 83.74,59.45 JP7.2
N$58
  Top 0.813: S4.2 S4.1 88.62,54.29 C14.2 85.49,54.37 83.9,54.37 81.36,56.91 JP7.3
N$59
  Top 0.813: S5.2 S5.1 85.61,47.27 C15.2 85.49,47.39 83.98,47.39 83.58,47.78 83.58,52.55 81.76,54.37 JP7.4
N$60
  Top 0.406: 82.39,46.75 84.22,44.93 84.22,40.48
  Top 0.61: 81.84,51.67 82.39,51.12 82.39,46.75 | 84.45,40.32 84.22,40.48
  Top 0.813: S6.2 S6.1 88.62,40.32 C16.2 84.45,40.32 | JP7.5 78.34,51.67 81.84,51.67
N$61
  Top 0.406: 83.26,39.45 83.26,44.29 81.36,46.2 | 81.36,49.21 81.28,49.29
  Top 0.61: 84.14,38.58 83.26,39.45 | 81.36,46.2 81.36,49.21 | 81.28,49.29 JP7.6
  Top 0.813: S7.2 S7.1 88.7,33.1 C18.2 85.49,33.18 84.77,33.18 84.14,33.81 84.14,38.58
N$62
  Top 0.406: 82.39,38.58 82.39,43.81 80.41,45.8
  Top 0.61: 82.95,38.02 82.39,38.58 | 80.41,45.8 80.41,46.75 80.09,46.75 JP7.7
  Top 0.813: S8.2 S8.1 88.63,25.96 C17.2 85.41,26.19 84.45,26.19 84.06,26.59 84.06,31.91 82.95,33.02 82.95,38.02
N$63
  Top 0.406: 81.52,37.54 81.52,43.18
  Top 0.61: 91.46,16.75 S9.2 | 89.06,16.75 87.87,17.78 85.57,17.86 | 81.68,37.39 81.52,37.54 | 81.52,43.18 80.49,44.21 JP7.8
  Top 0.813: 89.06,16.75 91.46,16.75 | 85.57,17.86 83.9,16.19 C19.2 81.68,16.83 81.68,37.39
N$64
  Top 1.27: 86.12,66.04 85.65,66.04 81.04,61.44 | 81.04,61.44 80.64,61.04 82.71,62.07 81.04,61.44
N$65
  Top 1.27: 80.96,60.96 83.03,60.96 83.5,61.44 83.5,63.82 83.74,63.98
N$66
  Top 1.27: 79.22,64.93 85.01,70.72
N$67
  Top 1.27: 74.06,62.63 71.28,61.99 67.47,65.96 72.79,65.96 72.47,66.28 72.47,65.8 70.17,63.5 70.17,63.18 75.17,58.18 75.17,64.93 75.72,65.01
N$68
  Top 1.27: 83.34,17.86 84.38,18.89
N$69
  Top 1.27: 84.53,16.19 85.41,16.19 85.41,17.14 85.88,17.62
N$70
  Top 0.813: 85.25,13.81 84.22,14.21 80.8,14.21
  Top 1.27: 87.23,12.14 87.23,12.54 85.96,13.81 85.25,13.81
N$71
  Top 1.27: 81.92,16.27 81.92,16.11
N$72
  Top 1.27: 84.22,16.27 84.14,16.19 81.99,16.19
N$73
  Top 1.27: 72.31,27.54 68.18,23.42 68.18,23.34
N$74
  Top 0.649: 18.97,64.69 18.97,57.71
  Top 0.9: 18.97,57.71 IC4.3
  Top 1.27: S1.5 S1.2 S1.3 S1.6 13.18,68.82 C20.+ 6.19,64.69 | 6.19,64.69 | IC2.1 6.19,64.69 | 6.19,64.69 18.97,64.69
N$75
  Top 1.676: 23.34,15.8 23.34,12.7 28.5,17.86
N$76
  Top 1.016: 13.41,55.88 14.05,55.88 17.14,58.98 | 17.14,58.98 | 13.41,55.24 17.14,58.98
N$77
  Top 1.016: 16.43,59.05 17.07,59.05
N$78
  Top 0.45: 64.77,18.57 64.85,18.57 66.52,20.24 66.52,19.84 65.64,18.97 65.64,17.7 65.72,17.62
N$79
  Top 0.649: 10.4,50.72 10.48,50.72 11.83,49.37 11.19,49.37 10.24,50.32
N$80
  Top 0.649: 18.18,49.53 18.89,49.53 20.72,49.53 21.19,49.05
RESET
  Top 0.254: IC1.4 57.82,12.91 57.78,12.7 | 53.9,9.76 53.9,10.79 R1.2
  Top 0.305: 56.75,12.7 57.78,12.7
  Top 0.406: 56.75,12.7 56.52,12.3 53.9,12.3 53.9,9.76 52.39,8.26 52.39,6.43 45.8,6.43 44.69,7.54 44.69,9.05 JP1.5
SCK
  Top 0.254: 23.89,3.65 SV1.6
  Top 0.27: 29.77,16.99 29.8,17.02 IC1.41
  Top 0.305: 20.08,3.33 20.08,5.08 20.64,5.64 22.07,5.64 22.62,6.19 22.62,9.84
  Top 0.406: 23.89,3.65 22.94,2.7 20.72,2.7 20.08,3.33 | 22.62,9.84 29.77,16.99
VCC  (via drill 0.6)
  Top 0.254: IC1.5 58.32,10.79 R1.1 | SV1.2 18.81,4.84 | 66.44,18.02 65.56,18.02 65.56,17.38 | 69.53,18.02 IC1.17 | 65.48,17.46 64.93,18.02 64.85,18.02 | 59.29,25.72 59.29,25.64 59.29,25.72
  Top 0.27: 59.29,25.64 IC1.27 | 34.92,18.52 IC1.38 | IC1.17 64.85,18.02 65.56,18.02
  Top 0.305: 18.81,4.84 20.08,6.11 20.08,7.78 | 34.05,18.97 34.92,18.52 34.35,18.52 v32.62,20.24 | 56.12,5.24 v54.61,6.67 | 56.12,5.24 57.31,5.24 C3.2 | 17.3,10.56 16.51,9.76 16.51,8.41 16.59,8.33 | 66.44,18.02 73.66,18.02 73.58,18.1 v74.69,18.57 | v53.74,3.49 56.12,3.97 56.12,5.24 | v50.16,13.34 49.85,13.02 JP1.2 | v68.5,18.81 69.53,18.02 | 60.06,26.43 v61.83,29.29 | 50.48,30.32 58.58,30.32 v58.74,28.73 58.58,26.67 | IC1.17
  Top 0.406: 20.08,7.78 19.53,8.33 16.59,8.33 14.05,8.33 R2.2 | 59.29,25.64 59.29,25.8 57.78,25.8 57.78,26.19 57.78,28.73 57.78,31.19 52.39,31.19 51.12,30.24 | 57.15,8.1 C3.2 R1.1 | v15.88,12.06 15.88,11.99 17.3,10.56 17.78,10.56 v19.13,11.91
  Top 0.408: 59.29,25.8 59.93,26.43 60.06,26.43
  Top 0.45: 6.19,47.07 6.19,44.77 | 6.19,44.77 6.19,44.53 R7.2 | v28.65,54.77 28.65,54.45 30.16,52.94 | v5.08,48.26 6.19,49.37 | 26.99,57.07 v25.88,58.58 | 26.99,57.07 30.34,57.07 32.12,55.29 | v25.08,55.01 26.99,55.88 26.99,57.07 | C4.2 56.27,26.19 57.78,26.19 | C11.2 8.26,44.77 6.19,44.77
  Top 0.61: 51.12,30.24 JP11.1 50.48,30.32
  Top 0.813: IC2.3 6.19,47.07
  Top 1.016: v25.88,58.58 24.21,57.71 21.43,57.71 21.24,57.9 C5.+
  Top 1.27: 30.16,52.94 32.12,55.29 32.22,55.4 32.23,64.77 JP4.31 | 30.16,52.94 32.23,55.32 | 6.19,49.37 IC2.3
  Bottom 0.305: v54.61,6.67 54.61,8.81 50.16,13.26 v50.16,13.34 | v32.62,20.24 27.46,20.24 v19.13,11.91 | v74.69,18.57 74.77,18.49 74.85,2.46 54.45,2.46 53.58,3.33 v53.74,3.49 | v68.5,18.81 68.5,20.88 v61.83,29.29 | v58.74,28.73 55.72,31.83 27.07,34.53
  Bottom 0.406: 25.8,35.88 27.07,34.53
  Bottom 0.45: 25.8,35.88 25.8,51.91 v28.65,54.77 | v5.08,48.26 15.32,48.26 v25.88,58.58 | v15.88,12.06 13.89,14.05 13.89,42.47 25.08,53.82 v25.08,55.01
VDD  (via drill 0.6)
  Top 0.254: U1.24 55.02,41.74
  Top 0.27: 55,44.46 U1.24 | IC1.20 63.49,19.52 71.91,27.94
  Top 0.305: 54.45,43.02 53.66,43.02 53.66,47.87 R4.1 | 54.45,43.02 55,44.46 | 71.91,27.94 71.91,28.97 | v54.61,45.32 54.85,42.87 54.45,43.02
  Top 0.406: 71.91,27.94 72.39,27.46 v72.31,24.29
  Top 0.813: JP4.27 37.31,52.55 33.66,48.9 33.66,43.5 32.38,42.23
  Top 1.016: JP4.27 | 31.27,42.23 v31.35,42.23 32.38,42.23 | v72.31,24.29 73.9,27.54 v73.9,27.78
  Bottom 0.305: v72.31,24.29 53.5,24.53 53.5,34.37 53.42,45.32 v54.61,45.32
  Bottom 0.406: v73.9,27.78 74.37,28.97 75.17,29.61 75.96,30.4 75.96,51.44 74.45,52.55 46.59,52.63 36.2,42.23 v31.35,42.23
VSS  (via drill 0.6)
  Top 0.254: 57.19,46.48 R3.1
  Top 0.27: 55.52,42.86 U1.23 | IC1.19 64.1,19.02 66.28,21.19
  Top 0.305: 57.11,43.66 56.28,42.86 55.52,42.86 | 57.11,43.66 57.19,46.48 | 66.28,21.19 76.44,21.19 76.44,27.3 76.44,32.62 76.44,32.86 | v57.63,45.01 57.35,43.81 57.11,43.66 | JP4.28 36.04,69.93 36.04,66.12 35.96,66.12
  Top 0.406: 74.22,33.02 v73.98,32.78 | 74.22,33.02 74.22,34.77 74.14,34.85 v74.14,35.4 | v30.56,46.12 31.91,47.47 32.31,47.47 | 74.22,33.02 74.61,32.62 76.44,32.62
  Top 0.813: 35.96,66.12 35.96,53.18 32.31,49.53 32.31,47.47
  Bottom 0.305: v73.98,32.78 72.79,32.78 63.5,42.47 59.61,42.47 v57.63,45.01
  Bottom 0.406: v74.14,35.4 70.72,38.81 70.72,50.56 66.44,54.85 42.31,54.85 33.58,46.12 v30.56,46.12
(copper drawn outside any net)
  shapes: Top area x564

### Text on the board
Top: 1 | +5V | Vref in | GND | Philipp Niethammer | Quadrocoper Mainboard | v 1.1 | (C) Alexander Kicherer | ISP | RXD | TXD | GND